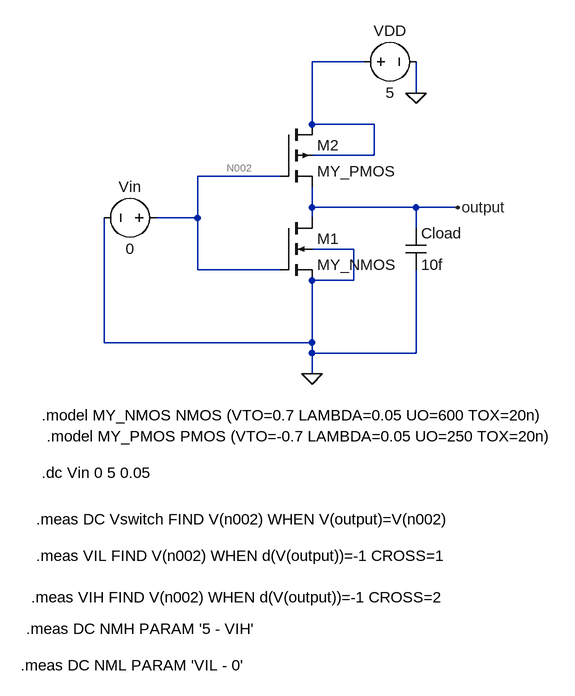
[diagram p0: schematic Inverter_VTC_symmetrical.asc]
Inverter_VTC_symmetrical.asc, the LTspice schematic file:
Version 4.1
SHEET 1 880 768
WIRE 384 -176 304 -176
WIRE 464 -128 464 -176
WIRE 304 -80 304 -176
WIRE 400 -80 304 -80
WIRE 400 -32 400 -80
WIRE 400 -32 304 -32
WIRE 256 0 128 0
WIRE 304 48 304 16
WIRE 464 48 304 48
WIRE 528 48 464 48
WIRE 128 64 128 0
WIRE 128 64 64 64
WIRE 304 64 304 48
WIRE 464 80 464 48
WIRE 368 112 304 112
WIRE 128 144 128 64
WIRE 256 144 128 144
WIRE 368 160 368 112
WIRE 368 160 304 160
WIRE -16 256 -16 64
WIRE 304 256 304 160
WIRE 304 256 -16 256
WIRE 304 272 304 256
WIRE 464 272 464 144
WIRE 464 272 304 272
WIRE 304 304 304 272
FLAG 304 304 0
FLAG 464 -128 0
FLAG 528 48 output
SYMBOL nmos4 256 64 R0
SYMATTR InstName M1
SYMATTR Value MY_NMOS
SYMATTR Value2 l=1u w=1u
SYMBOL voltage 80 64 R90
WINDOW 0 -32 56 VBottom 2
WINDOW 3 32 56 VTop 2
WINDOW 123 0 0 Left 0
WINDOW 39 0 0 Left 0
SYMATTR InstName Vin
SYMATTR Value 0
SYMBOL voltage 368 -176 R270
WINDOW 0 32 56 VTop 2
WINDOW 3 -32 56 VBottom 2
WINDOW 123 0 0 Left 0
WINDOW 39 0 0 Left 0
SYMATTR InstName VDD
SYMATTR Value 5
SYMBOL cap 448 80 R0
SYMATTR InstName Cload
SYMATTR Value 10f
SYMBOL pmos4 256 -80 R0
SYMATTR InstName M2
SYMATTR Value MY_PMOS
SYMATTR Value2 l=1u w=1u
TEXT -112 368 Left 2 !.model MY_NMOS NMOS (VTO=0.7 LAMBDA=0.05 UO=600 TOX=20n)
TEXT -104 400 Left 2 !.model MY_PMOS PMOS (VTO=-0.7 LAMBDA=0.05 UO=250 TOX=20n)
TEXT -112 456 Left 2 !.dc Vin 0 5 0.05
TEXT -120 528 Left 2 !.meas DC Vswitch FIND V(n002) WHEN V(output)=V(n002)
TEXT -120 584 Left 2 !.meas VIL FIND V(n002) WHEN d(V(output))=-1 CROSS=1
TEXT -128 648 Left 2 !.meas VIH FIND V(n002) WHEN d(V(output))=-1 CROSS=2
TEXT -136 696 Left 2 !.meas DC NMH PARAM '5 - VIH'
TEXT -144 752 Left 2 !.meas DC NML PARAM 'VIL - 0'

The netlist it stands for:
* Inverter_VTC_symmetrical.asc
M1 output N002 0 0 MY_NMOS l=1u w=1u
Vin N002 0 0
VDD N001 0 5
Cload output 0 10f
M2 N001 N002 output N001 MY_PMOS l=1u w=1u
.model NMOS NMOS
.model PMOS PMOS
.lib standard.mos
.model MY_NMOS NMOS (VTO=0.7 LAMBDA=0.05 UO=600 TOX=20n)
.model MY_PMOS PMOS (VTO=-0.7 LAMBDA=0.05 UO=250 TOX=20n)
.dc Vin 0 5 0.05
.meas DC Vswitch FIND V(n002) WHEN V(output)=V(n002)
.meas VIL FIND V(n002) WHEN d(V(output))=-1 CROSS=1
.meas VIH FIND V(n002) WHEN d(V(output))=-1 CROSS=2
.meas DC NMH PARAM '5 - VIH'
.meas DC NML PARAM 'VIL - 0'
.backanno
.end